# EAGLE schematic voltage regulator (EAGLE 6.1)
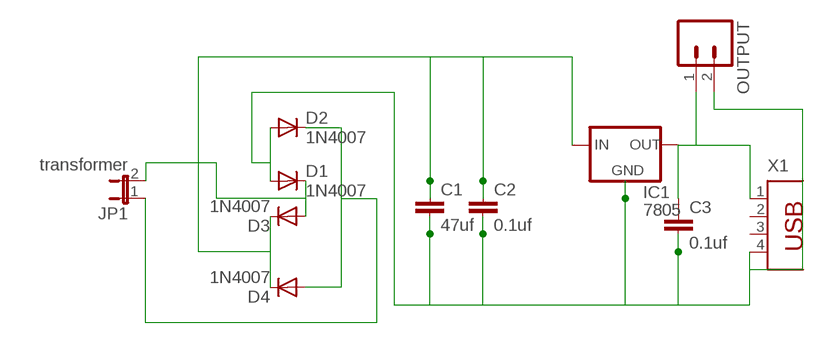
[diagram p0: schematic, sheet 1]

## Parts
C1  47uf  C2,5-3  [C2.5-3]
C2  0.1uf  C2,5-3  [C2.5-3]
C3  0.1uf  C2,5-3  [C2.5-3]
D1  1N4007  1N4004  [DO41-10]
D2  1N4007  1N4004  [DO41-10]
D3  1N4007  1N4004  [DO41-10]
D4  1N4007  1N4004  [DO41-10]
IC1  7805  78XXL  [78XXL]
JP1  transformer  JP1E  [JP1]
OUTPUT  M02  [02P]
X1  PN87520  [PN87520]

## Nets
N$1: C1.2 C2.2 C3.2 D1.A D2.A IC1.GND OUTPUT.2 X1.4
N$2: C1.1 C2.1 D3.C D4.C IC1.IN
N$3: D2.C D4.A JP1.1
N$4: D1.C D3.A JP1.2
N$5: C3.1 IC1.OUT OUTPUT.1 X1.1
Unconnected: X1.2 X1.3

## Library data of the parts
C1-C3 = capacitor-wima:C: CAPACITOR naming: grid - package width
D1-D4 = diode:1N4004: DIODE general purpose rectifier, 1 A
IC1 = v-reg:78XXL: VOLTAGE REGULATOR
JP1 = jumper:JP1E: JUMPER
OUTPUT = con-amp-quick:M02: AMP QUICK CONNECTOR; OC_FARNELL: unknown; OC_NEWARK: unknown
X1 = con-berg:PN87520: BERG USB connector; OC_FARNELL: unknown; OC_NEWARK: unknown